# Altium schematic sheet key_count.SchDoc
size A4
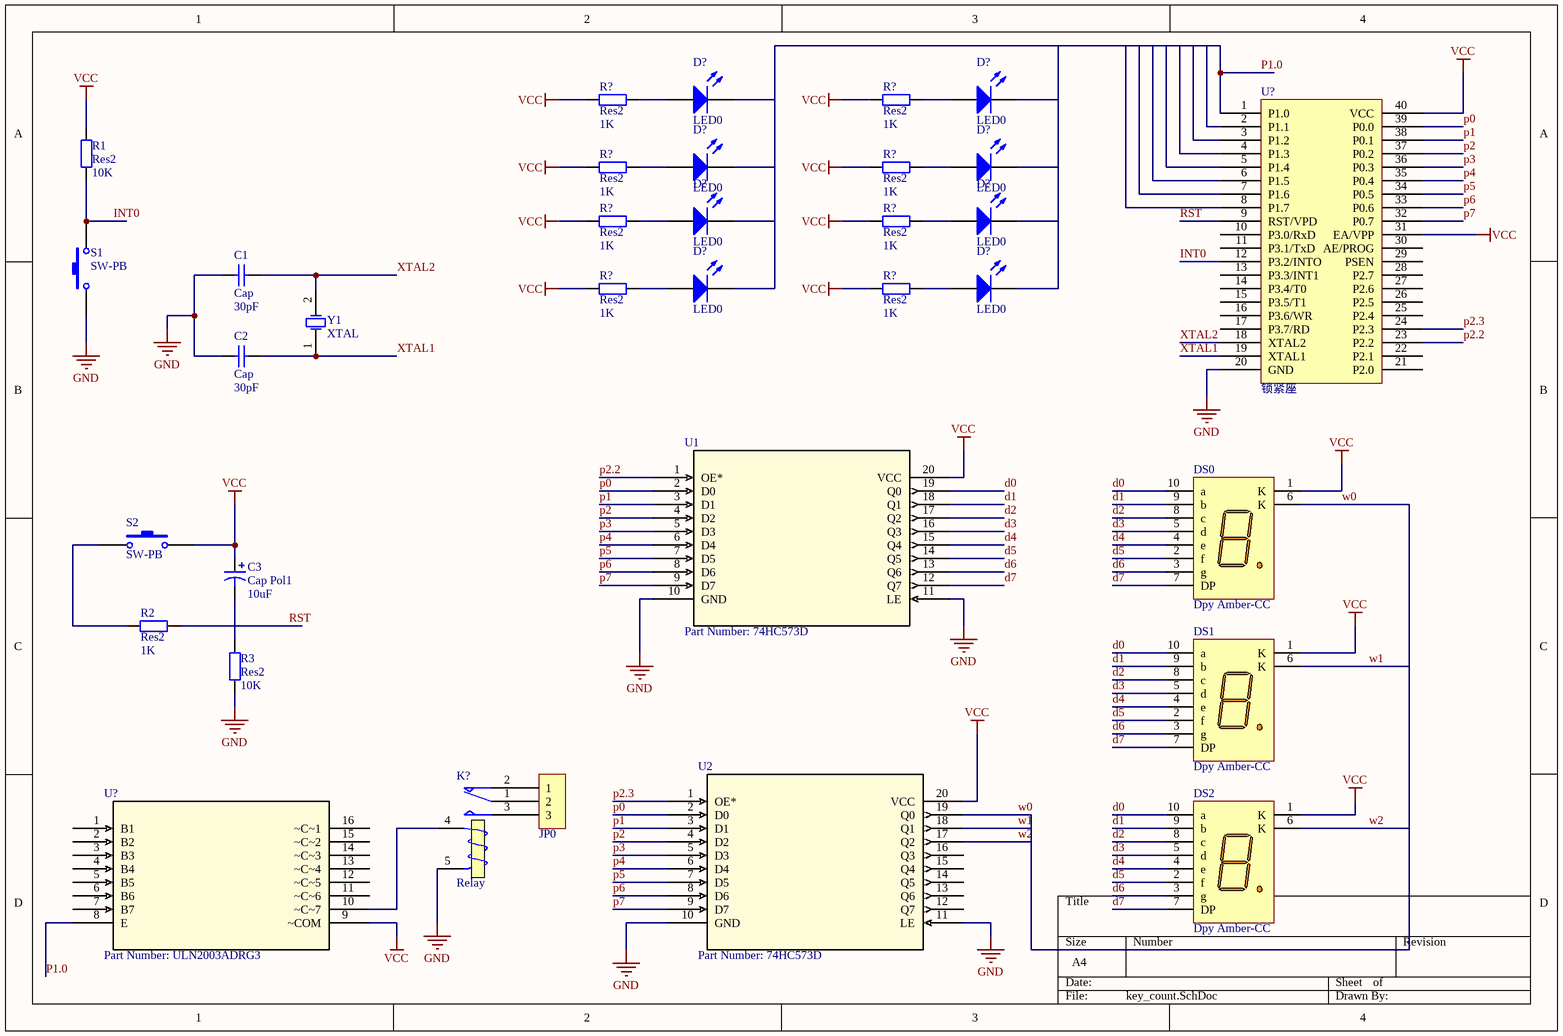
[diagram p0: key_count.SchDoc]

## Parts
(Parts that share a designator on the sheet are numbered #1, #2 ... from top to bottom, then left to right.)
C1  Cap  value 30pF  [RAD-0.3]
C2  Cap  value 30pF  [RAD-0.3]
C3  Cap Pol1  value 10uF  [RB7.6-15]
D?#1  LED0  [LED-0]
D?#2  LED0  [LED-0]
D?#3  LED0  [LED-0]
D?#4  LED0  [LED-0]
D?#5  LED0  [LED-0]
D?#6  LED0  [LED-0]
D?#7  LED0  [LED-0]
D?#8  LED0  [LED-0]
DS0  Dpy Amber-CC  [A]
DS1  Dpy Amber-CC  [A]
DS2  Dpy Amber-CC  [A]
JP0  晶振  [HDR-1X3_M]  (value not drawn)
K?  Relay  [MODULE5B]
R1  Res2  value 10K  [AXIAL-0.4]
R2  Res2  value 1K  [AXIAL-0.4]
R3  Res2  value 10K  [AXIAL-0.4]
R?#1  Res2  value 1K  [AXIAL-0.4]
R?#2  Res2  value 1K  [AXIAL-0.4]
R?#3  Res2  value 1K  [AXIAL-0.4]
R?#4  Res2  value 1K  [AXIAL-0.4]
R?#5  Res2  value 1K  [AXIAL-0.4]
R?#6  Res2  value 1K  [AXIAL-0.4]
R?#7  Res2  value 1K  [AXIAL-0.4]
R?#8  Res2  value 1K  [AXIAL-0.4]
S1  SW-PB  [SPST-2]
S2  SW-PB  [SPST-2]
U1  Part Number: 74HC573D  [SOT163-1]
U2  Part Number: 74HC573D  [SOT163-1]
U?#1  锁紧座  [DIP_TP40-600]
U?#2  Part Number: ULN2003ADRG3  [D16]
Y1  XTAL  [R38]

## Nets
GND: C1.1 C2.1 K?.5(T2) R3.1 S1.1 U1.10(GND) U1.11(LE) U2.10(GND) U2.11(LE) U?#1.20(GND)
VCC: C3.1 DS0.1(K) DS1.1(K) DS2.1(K) R1.2 R?#1.2 R?#2.2 R?#3.2 R?#4.2 R?#5.2 R?#6.2 R?#7.2 R?#8.2 S2.2 U1.20(VCC) U2.20(VCC) U?#1.31(EA/VPP) U?#1.40(VCC) U?#2.9(~COM)
d0: DS0.10(a) DS1.10(a) DS2.10(a) U1.19(Q0)
d1: DS0.9(b) DS1.9(b) DS2.9(b) U1.18(Q1)
d2: DS0.8(c) DS1.8(c) DS2.8(c) U1.17(Q2)
d3: DS0.5(d) DS1.5(d) DS2.5(d) U1.16(Q3)
d4: DS0.4(e) DS1.4(e) DS2.4(e) U1.15(Q4)
d5: DS0.2(f) DS1.2(f) DS2.2(f) U1.14(Q5)
d6: DS0.3(g) DS1.3(g) DS2.3(g) U1.13(Q6)
d7: DS0.7(DP) DS1.7(DP) DS2.7(DP) U1.12(Q7)
INT0: R1.1 S1.2 U?#1.12(P3.2/INTO)
p0: U1.2(D0) U2.2(D0) U?#1.39(P0.0)
p1: U1.3(D1) U2.3(D1) U?#1.38(P0.1)
P1.0: U?#1.1(P1.0) U?#2.8(E)
p2: U1.4(D2) U2.4(D2) U?#1.37(P0.2)
p2.2: U1.1(OE*) U?#1.23(P2.2)
p2.3: U2.1(OE*) U?#1.24(P2.3)
p3: U1.5(D3) U2.5(D3) U?#1.36(P0.3)
p4: U1.6(D4) U2.6(D4) U?#1.35(P0.4)
p5: U1.7(D5) U2.7(D5) U?#1.34(P0.5)
p6: U1.8(D6) U2.8(D6) U?#1.33(P0.6)
p7: U1.9(D7) U2.9(D7) U?#1.32(P0.7)
RST: R2.2 U?#1.9(RST/VPD)
w0: DS0.6(K) U2.19(Q0)
w1: DS1.6(K) U2.18(Q1)
w2: DS2.6(K) U2.17(Q2)
XTAL1: C2.2 U?#1.19(XTAL1) Y1.1(OSC1)
XTAL2: C1.2 U?#1.18(XTAL2) Y1.2(OSC2)
NetC3_2: C3.2 R3.2
NetD?#1_1: D?#1.1(A) R?#1.1
NetD?#2_1: D?#2.1(A) R?#2.1
NetD?#3_1: D?#3.1(A) R?#3.1
NetD?#4_1: D?#4.1(A) R?#4.1
NetD?#5_1: D?#5.1(A) R?#5.1
NetD?#6_1: D?#6.1(A) R?#6.1
NetD?#7_1: D?#7.1(A) R?#7.1
NetD?#8_1: D?#8.1(A) R?#8.1
NetJP0_1: JP0.1 K?.2(NC)
NetJP0_2: JP0.2 K?.1(COM)
NetJP0_3: JP0.3 K?.3(NO)
NetK?_4: K?.4(T1) U?#2.10(~C~7)
NetR2_1: R2.1 S2.1

Not connected (* = marked no-connect by the designer): D?#1 2(K); D?#2 2(K); D?#3 2(K); D?#4 2(K); D?#5 2(K); D?#6 2(K); D?#7 2(K); D?#8 2(K); U2 12(Q7) 13(Q6) 14(Q5) 15(Q4) 16(Q3); U?#1 2(P1.1) 3(P1.2) 4(P1.3) 5(P1.4) 6(P1.5) 7(P1.6) 8(P1.7) 10(P3.0/RxD) 11(P3.1/TxD) 13(P3.3/INT1) 14(P3.4/T0) 15(P3.5/T1) 16(P3.6/WR) 17(P3.7/RD) 21(P2.0) 22(P2.1) 25(P2.4) 26(P2.5) 27(P2.6) 28(P2.7) 29(PSEN) 30(AE/PROG); U?#2 1(B1) 2(B2) 3(B3) 4(B4) 5(B5) 6(B6) 7(B7) 11(~C~6) 12(~C~5) 13(~C~4) 14(~C~3) 15(~C~2) 16(~C~1)

## Library data of the parts
C1 C2 = Cap: Capacitor; Published: 8-Jun-2000; LatestRevisionDate: 17-Jul-2002; LatestRevisionNote: Re-released for DXP Platform.; PackageReference: RAD-0.3; Publisher: Altium Limited; PackageDescription: Radial Cap, Thru-Hole; 2 Leads; 0.3 in Pin Spacing
C3 = Cap Pol1: Polarized Capacitor (Radial); Published: 8-Jun-2000; LatestRevisionDate: 17-Jul-2002; LatestRevisionNote: Re-released for DXP Platform.; PackageReference: RB7.6-15; Publisher: Altium Limited; PackageDescription: Polarized Capacitor (Radial); 2 Leads
D?#1-D?#8 = LED0: Typical INFRARED GaAs LED; Published: 8-Jun-2000; LatestRevisionDate: 08-Jul-2005; LatestRevisionNote: Mech Layer 1 removed.; PackageReference: LED-0; Publisher: Altium Limited; PackageDescription: LED; 2 Leads
DS0-DS2 = Dpy Amber-CC: 7.62 mm Black Surface Orange 7-Segment Display: CC, RH DP; MinimumIntensity: 354 ucd; Note: IF = 5 mA; Note: Pins 1 and 6 are redundant Cathodes.; Published: 8-Jun-2000; LatestRevisionDate: 17-Dec-2003; LatestRevisionNote: Schematic revised, PCB Footprint replaced.; DatasheetVersion: 19-Feb-2002; PackageVersion: 11-Feb-2002; PackageReference: A; Publisher: Altium Limited; PackageDescription: LED, 7-Segment Display, 7.62 mm, RHD; 10 Leads; Row Space 5.08 mm; Pitch 2.54 mm; Colour: Orange; ComponentLink1Description: Manufacturer Link; ComponentLink1URL: http://www.agilent.com/
JP0 = Header 3: 3P接插件; 版权归属: 黎明电子style; BOM名称: 3P接插件; 学习资源: https://lmdzstyle.taobao.com/
K? = Relay: SPDT Relay; Published: 8-Jun-2000; LatestRevisionDate: 17-Jul-2002; LatestRevisionNote: Re-released for DXP Platform.; PackageReference: MODULE5B; Publisher: Altium Limited
R1-R3 R?#1-R?#8 = Res2: Resistor; Published: 8-Jun-2000; LatestRevisionDate: 17-Jul-2002; LatestRevisionNote: Re-released for DXP Platform.; PackageReference: AXIAL-0.4; Publisher: Altium Limited; PackageDescription: Axial Device, Thru-Hole; 2 Leads; 0.4 in Pin Spacing
S1 S2 = SW-PB: Switch; Published: 24-Mar-1999; LatestRevisionDate: 17-Jul-2002; LatestRevisionNote: Re-released for DXP Platform.; PackageReference: SPST-2; Publisher: Altium Limited; PackageDescription: Switch; 2 Leads
U1 U2 = 74HC573D: No Description Available; Vendor: Nexperia; Manufacturer_Part_Number: 74HC573D; Copyright: Copyright (C) 2016 Accelerated Designs. All rights reserved; RefDes: RefDes; Type: DEV; Value: Value
U?#1 = STC89C52
U?#2 = ULN2003ADRG3: No Description Available; Vendor: Texas Instruments; Built_By: EMA_UL_Team; Manufacturer_Part_Number: ULN2003ADRG3; Copyright: Copyright (C) 2018 Accelerated Designs. All rights reserved; RefDes: RefDes; Type: DEV; Value: Value
Y1 = XTAL: Crystal Oscillator; Published: 8-Jun-2000; LatestRevisionDate: 17-Jul-2002; LatestRevisionNote: Re-released for DXP Platform.; PackageReference: R38; Publisher: Altium Limited; PackageDescription: Crystal, Thru-Hole; 2 Leads; Body 3.1 x 8.2 mm (Dia.xH)